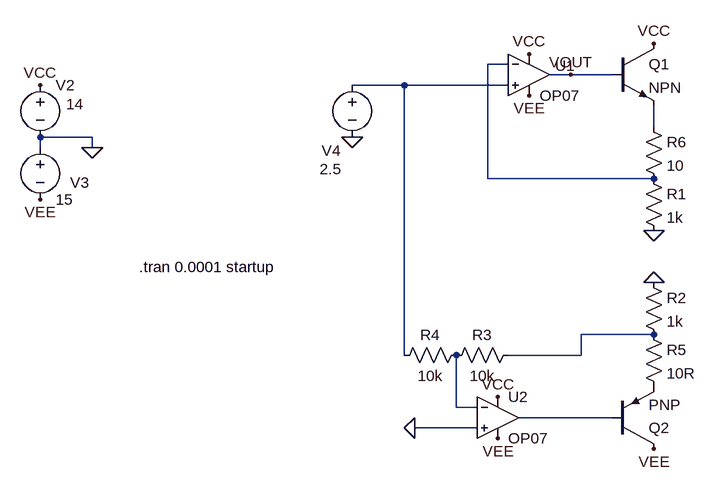
[diagram p0: schematic Draft05.asc]
Draft05.asc, the LTspice schematic file:
Version 4
SHEET 1 904 680
WIRE 448 -32 416 -32
WIRE 544 -16 512 -16
WIRE 608 -16 544 -16
WIRE 288 0 208 0
WIRE 448 0 288 0
WIRE 672 64 672 32
WIRE -192 80 -272 80
WIRE -272 96 -272 80
WIRE -192 96 -192 80
WIRE 416 144 416 -32
WIRE 672 144 416 144
WIRE 672 384 560 384
WIRE 288 416 288 0
WIRE 560 416 560 384
WIRE 560 416 448 416
WIRE 368 496 368 416
WIRE 400 496 368 496
WIRE 608 512 464 512
WIRE 400 528 304 528
FLAG -192 96 0
FLAG 544 -16 VOUT
FLAG 208 80 0
FLAG -272 0 VCC
FLAG -272 176 VEE
FLAG 480 16 VEE
FLAG 672 -64 VCC
FLAG 480 -48 VCC
FLAG 672 224 0
FLAG 432 480 VCC
FLAG 432 544 VEE
FLAG 672 560 VEE
FLAG 672 304 0
FLAG 304 528 0
SYMBOL OpAmps\\OP07 480 -80 R0
WINDOW 0 40 50 Left 2
SYMATTR InstName U1
SYMBOL voltage -272 -16 R0
WINDOW 123 0 0 Left 0
WINDOW 39 0 0 Left 0
WINDOW 3 40 45 Left 2
SYMATTR Value 14
SYMATTR InstName V2
SYMBOL voltage -272 80 R0
WINDOW 123 0 0 Left 0
WINDOW 39 0 0 Left 0
WINDOW 0 46 70 Left 2
SYMATTR InstName V3
SYMATTR Value 15
SYMBOL voltage 208 -16 R0
WINDOW 0 -47 117 Left 2
WINDOW 3 -50 145 Left 2
WINDOW 123 0 0 Left 0
WINDOW 39 0 0 Left 0
SYMATTR InstName V4
SYMATTR Value 2.5
SYMBOL npn 608 -64 R0
SYMATTR InstName Q1
SYMBOL res 656 128 R0
SYMATTR InstName R1
SYMATTR Value 1k
SYMBOL OpAmps\\OP07 432 448 R0
SYMATTR InstName U2
SYMBOL pnp 608 560 M180
SYMATTR InstName Q2
SYMBOL res 656 288 R0
SYMATTR InstName R2
SYMATTR Value 1k
SYMBOL res 464 400 R90
WINDOW 0 0 56 VBottom 2
WINDOW 3 32 56 VTop 2
SYMATTR InstName R3
SYMATTR Value 10k
SYMBOL res 384 400 R90
WINDOW 0 0 56 VBottom 2
WINDOW 3 32 56 VTop 2
SYMATTR InstName R4
SYMATTR Value 10k
SYMBOL res 656 368 R0
SYMATTR InstName R5
SYMATTR Value 10R
SYMBOL res 656 48 R0
SYMATTR InstName R6
SYMATTR Value 10
TEXT -120 280 Left 2 !.tran 0.0001 startup

The netlist it stands for:
* Draft05.asc
XU1 N002 N001 VCC VEE VOUT LT1001  ; OP07, pins In+ In- V+ V- OUT
V2 VCC 0 14
V3 0 VEE 15
V4 N002 0 2.5
Q1 VCC VOUT N003 0 NPN
R1 N001 0 1k
XU2 0 N005 VCC VEE N006 LT1001  ; OP07, pins In+ In- V+ V- OUT
Q2 VEE N006 P001 0 PNP
R2 0 N004 1k
R3 N004 N005 10k
R4 N005 N002 10k
R5 N004 P001 10R
R6 N003 N001 10
.model NPN NPN
.model PNP PNP
.lib standard.bjt
.tran 0.0001 startup
.lib LTC.lib
.backanno
.end